# Altium schematic sheet Sheet5_Misc.SchDoc
size A4; SheetNumber: 5; SheetTotal: 5
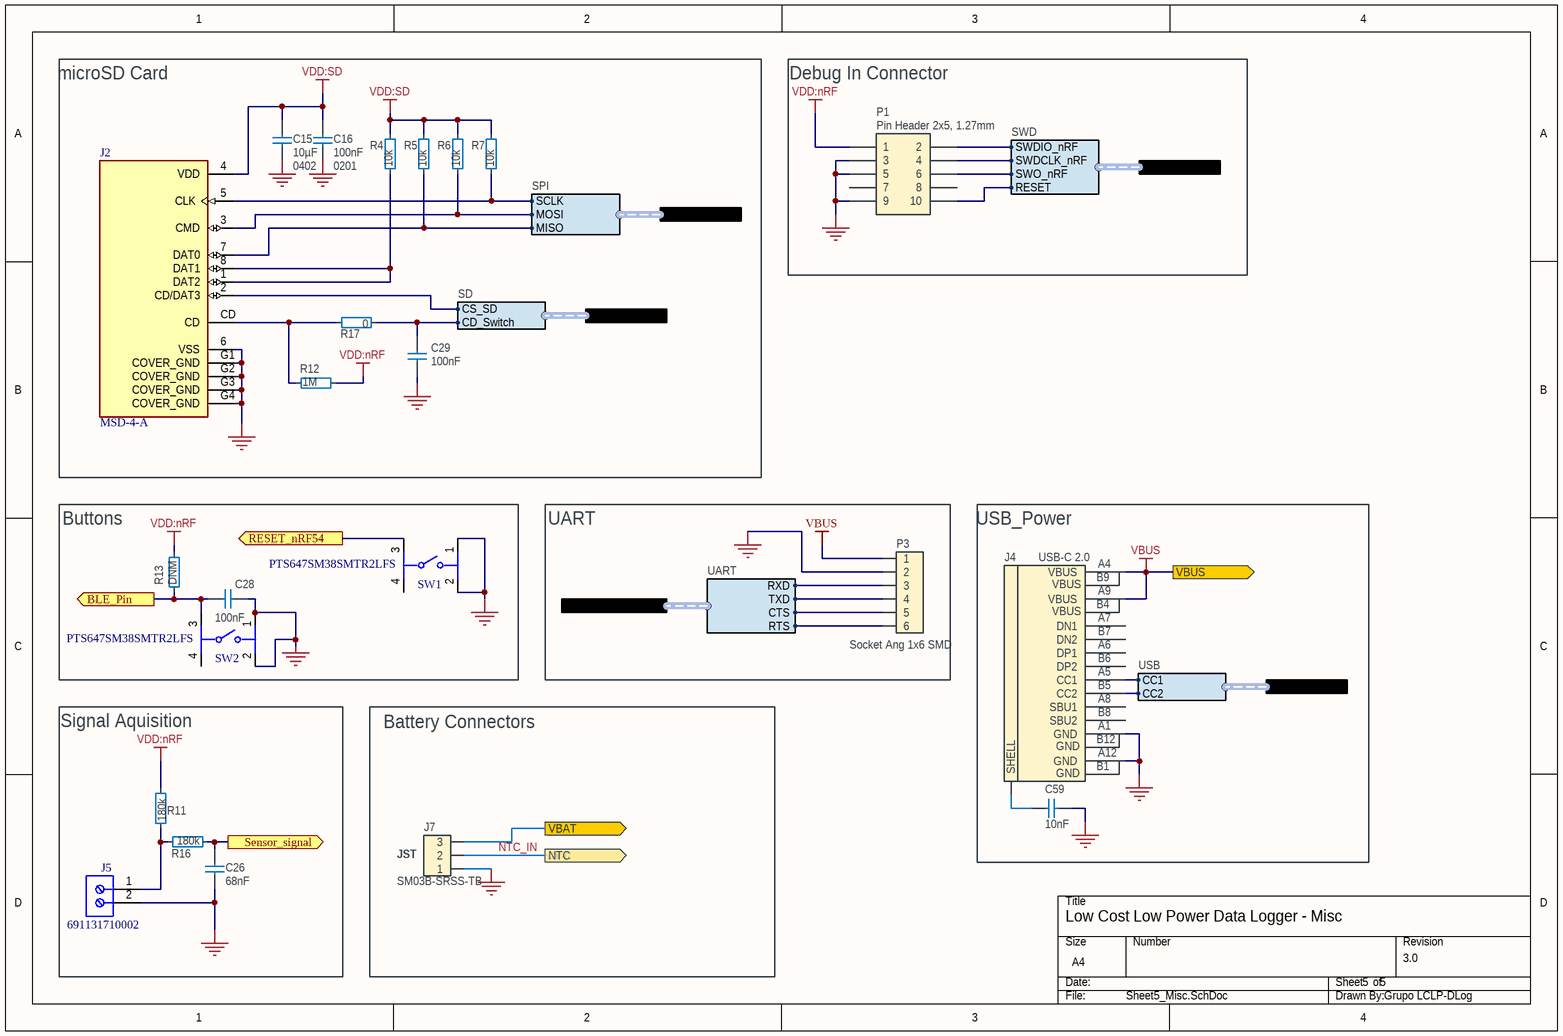
[diagram p0: Sheet5_Misc.SchDoc]

## Parts
C15  10µF  Footprint Doc: 0402  [CAPC1005X04L]
C16  100nF  Footprint Doc: 0201  [CAPC0603X03L_C]
C26  68nF  [CAPC1608X06L]
C28  100nF  [CAPC1608X06L]
C29  100nF  [CAPC1608X06L]
C59  10nF  [CAPC1608X06L]
J2  MSD-4-A  [CUI_MSD-4-A]
J4  USB-C 2.0  [SD-80259-001]
J5  691131710002  [691131710002]
J7  HDR-3, 1mm  [SM03B-SRSS-TB]  (value not drawn)
P1  Pin Header 2x5, 1.27mm  [HDR_2x5-SMD-1.27mm-K]
P3  Socket Ang 1x6 SMD  [SOCKET_1x6_SMD-ANG]
R4  10k  [RESC0603X03L_C]
R5  10k  [RESC0603X03L_C]
R6  10k  [RESC0603X03L_C]
R7  10k  [RESC0603X03L_C]
R11  180k  [RESC1005X04L]
R12  1M  [RESC1005X04L]
R13  DNM  [RESC1005X04L_NC]
R16  180k  [RESC1005X04L]
R17  0  [RESC1005X04L]
SW1  PTS647SM38SMTR2LFS  [FP-PTS647SM38SMTR2LFS-MFG]
SW2  PTS647SM38SMTR2LFS  [FP-PTS647SM38SMTR2LFS-MFG]

## Blocks framed on the sheet
microSD Card: C15 C16 C29 J2 R4-R7 R12 R17
Debug In Connector: P1
Buttons: C28 R13 SW1 SW2
UART: P3
USB_Power: C59 J4
Signal Aquisition: C26 J5 R11 R16
Battery Connectors: J7

## Ports
BLE_Pin (out, see Sheet1_Connections[4C], Sheet2_nRF54L15[4B]), NTC (out, see Sheet1_Connections[4C], Sheet3_Power_Managment[1B]), RESET_nRF54 (out, see Sheet1_Connections[4C], Sheet2_nRF54L15[4B]), SD_Pins (harness SD, see Sheet1_Connections[4B], Sheet2_nRF54L15[4A]), Sensor_signal (out, see Sheet1_Connections[4C], Sheet2_nRF54L15[4B]), SPI22 (harness SPI, see Sheet1_Connections[4B], Sheet2_nRF54L15[4A], Sheet4_Communications[2B]), SWD_Pins (harness SWD, see Sheet1_Connections[4B], Sheet2_nRF54L15[4B]), UART0_nRF54 (harness UART, see Sheet1_Connections[4B], Sheet2_nRF54L15[4B]), USB_CC (harness USB, see Sheet1_Connections[4C], Sheet3_Power_Managment[1A]), VBAT (out, see Sheet1_Connections[4C], Sheet3_Power_Managment[1B]), VBUS (out, see Sheet1_Connections[4C], Sheet3_Power_Managment[1A])

## Harnesses
SD: CS_SD, CD_Switch
UART: RXD, TXD, RTS, CTS
SPI: MISO, MOSI, SCLK
SWD: SWDIO_nRF, SWDCLK_nRF, SWO_nRF, RESET
USB: CC2, CC1

## Nets
GND: C15.1 C16.2 C26.1 C28.1 C29.1 C59.2 J2.6(VSS) J2.G1(COVER_GND) J2.G2(COVER_GND) J2.G3(COVER_GND) J2.G4(COVER_GND) J4.A1(GND) J4.A12(GND) J5.2 J7.1 P1.3 P1.5 P1.9 P3.2 SW1.1 SW1.2 SW2.1 SW2.2
VBUS: J4.A4(VBUS) J4.A9(VBUS) P3.1 ; port VBUS
VDD:nRF: P1.1 R11.2 R12.2 R13.2
VDD:SD: C15.2 C16.1 J2.4(VDD) R4.1 R5.1 R6.1 R7.1
BLE_Pin: C28.2 R13.1 SW2.3 ; port BLE_Pin
NTC_IN: J7.2 ; port NTC
RESET_nRF54: SW1.3 ; port RESET_nRF54
Sensor_signal: C26.2 R16.1 ; port Sensor_signal
VBAT: J7.3 ; port VBAT
NetC29_2: C29.2 R17.1 ; port SD_Pins.CD_Switch
NetC59_1: C59.1 J4.SHLD(SHELL)
NetJ2_1: J2.1(DAT2) J2.8(DAT1) R4.2
NetJ2_2: J2.2(CD/DAT3) ; port SD_Pins.CS_SD
NetJ2_3: J2.3(CMD) R6.2 ; port SPI22.MOSI
NetJ2_5: J2.5(CLK) R7.2 ; port SPI22.SCLK
NetJ2_7: J2.7(DAT0) R5.2 ; port SPI22.MISO
NetJ2_CD: J2.CD R12.1 R17.2
NetJ4_A5: J4.A5(CC1) ; port USB_CC.CC1
NetJ4_B5: J4.B5(CC2) ; port USB_CC.CC2
NetJ5_1: J5.1 R11.1 R16.2
NetP1_2: P1.2 ; port SWD_Pins.SWDIO_nRF
NetP1_4: P1.4 ; port SWD_Pins.SWDCLK_nRF
NetP1_6: P1.6 ; port SWD_Pins.SWO_nRF
NetP1_10: P1.10 ; port SWD_Pins.RESET
NetP3_3: P3.3 ; port UART0_nRF54.RXD
NetP3_4: P3.4 ; port UART0_nRF54.TXD
NetP3_5: P3.5 ; port UART0_nRF54.CTS
NetP3_6: P3.6 ; port UART0_nRF54.RTS

Not connected (* = marked no-connect by the designer): J4 A6(DP1) A7(DN1) A8(SBU1) B6(DP2) B7(DN2) B8(SBU2); P1 7 8; SW1 4; SW2 4

## Notes on the sheet
- (near J7) JST
- Low Cost Low Power Data Logger - Misc
- 5
- 3.0
- Grupo LCLP-DLog
- (in symbol SD-80259-1021) B9; B4; B12; B1

## Library data of the parts
C15 = C0402-10µF-6.3V-X6S: Capacitor, X6S, ±20%, 6.3V; Manufacturer: N.A.; Part number NEMS: 100200478; Component Status: Active; Pad Count: 2; Part Number: C0402-10µF-6.3V-X6S; PartId: 100200478; Component Class: Capacitors; Author: getr; Manufacturer Part Number: N.A.; ComponentLink1URL: N.A.; ComponentLink1Description: Datasheet; ComponentLink2URL: N.A.; ComponentLink2Description: Supplier link; HelpURL: N.A.; LatestRevisionDate: 2021-06-25; Published: 2021-06-25; Value: 10µF; Note: 6.3V; Supplier 1: N.A.; Supplier Part Number 1: N.A.; Supplier 2: N.A.; Supplier Part Number 2: N.A.; Artikkelnr Noca: N.A.; Part number IPS: N.A.; Part number Norautron: N.A.
C16 = C0201-100n-10V-X7R: Capacitor, X7R, ±10%; Manufacturer: N.A.; Part number NEMS: 100200469; Note: 10V; Pad Count: 2; Component Status: Active; Part Number: C0201-100n-10V-X7R; Manufacturer Part Number: N.A.; LatestRevisionDate: 2021-04-12; Published: 2021-04-12; Value: 100nF; Artikkelnr Noca: N.A.; Part number IPS: N.A.; ComponentLink1URL: N.A.; ComponentLink1Description: Datasheet; ComponentLink2URL: N.A.; ComponentLink2Description: Supplier link; HelpURL: N.A.; Supplier 1: N.A.; Supplier Part Number 1: N.A.; Supplier 2: N.A.; Supplier Part Number 2: N.A.; Component Class: Capacitors; Author: getr; Part number Norautron: N.A.; PartId: 100200469
C26 C28 C29 = C0603-10µ: Capacitor, X5R, ±20%; Manufacturer: N.A.; Part number IPS: 00000007785; Part number NEMS: 100200275; Value: 10µF; Note: 6.3V; Artikkelnr Noca: 20039234; Pad Count: 2; Component Status: Active; Part Number: C0603-10µ; Manufacturer Part Number: N.A.; ComponentLink1URL: N.A.; ComponentLink1Description: Datasheet; ComponentLink2URL: N.A.; ComponentLink2Description: Supplier link; HelpURL: N.A.; Footprint Doc: 0603; LatestRevisionDate: 2011-01-17; Published: 2011-01-17; Supplier 1: N.A.; Supplier Part Number 1: N.A.; Supplier 2: N.A.; Supplier Part Number 2: N.A.; Component Class: Capacitors; PartId: 100200275; Author: rsk; Part number Norautron: N.A.
C59 = C0603-10n-100V-X7R: Capacitor, X7R, ±10%, 100V; Manufacturer: Murata; Manufacturer Part Number: GCM188R72A103KA37D; Part number NEMS: 100200349; Component Status: Active; Pad Count: 2; Artikkelnr Noca: N.A.; Part Number: C0603-10n-100V-X7R; PartId: 100200349; Component Class: Capacitors; Author: rsk; ComponentLink1URL: N.A.; ComponentLink1Description: Datasheet; ComponentLink2URL: N.A.; ComponentLink2Description: Supplier link; HelpURL: http://psearch.en.murata.com/capacitor/product/GCM188R72A103KA37%23.pdf; LatestRevisionDate: 2017-08-22; Published: 2017-08-22; Footprint Doc: 0603; Value: 10nF; Note: 100V; Supplier 1: Digi-Key; Supplier Part Number 1: 490-4781-1-ND; Supplier 2: N.A.; Supplier Part Number 2: N.A.; Part number IPS: N.A.; Part number Norautron: N.A.
J2 = CMP-002-00071-3: Micro SD Card Connector, 9 Positions, Connector and Ejector, Push In, Auto Eject Out, Surface Mount, 1.8 mm Height Above Board, Gold Flash; MF: Same Sky; Pins: 13; Design Item ID: MSD-4-A; Case/Package: None; Source: MSD-4-A.SchLib; Component Type: Standard; Check_prices: https://www.snapeda.com/parts/MSD-4-A/Same+Sky/view-part/?ref=eda; Value: *; SnapEDA_Link: https://www.snapeda.com/parts/MSD-4-A/Same+Sky/view-part/?ref=snap; MP: MSD-4-A
J4 = SD-80259-1021: USB-C Receptacle, 16 Pin, USB 2.0; Manufacturer: Bellweather Electronic Corp.; Part number NEMS: 100500830; Component Status: Active; Pad Count: 16; Note: N.A.; System: Connector; Part Number: SD-80259-1021; PartId: 100500830; Component Class: Connectors; Author: getr; Manufacturer Part Number: SD-80259-1021; ComponentLink1URL: \\hizz\pro\app9717\Datasheet\connectors\Bellwether\SD-80259-001_C.pdf; ComponentLink1Description: Datasheet; ComponentLink2URL: N.A.; ComponentLink2Description: Supplier link; HelpURL: N.A.; LatestRevisionDate: 2023-10-30; Published: 2023-10-30; Footprint Doc: SD-80259-001; Value: USB-C 2.0; Supplier 1: Cabcon; Supplier Part Number 1: SD-80259-1021; Supplier 2: N.A.; Supplier Part Number 2: N.A.; Artikkelnr Noca: N.A.; Part number IPS: N.A.; Part number Norautron: N.A.
J5 = CMP-002-00090-1: Terminal Block, 5MM Pitch, Horizontal, Pressure Clamp, 30-12 AWG, 2 Pins, Gry; Mounting Technology: Through Hole; Min Operating Temperature: -30°C; Pins: 2; Max Operating Temperature: 120°C
J7 = SM03B-SRSS-TB: 1.0mm pitch connector side entry SMD; Manufacturer: JST Sales America Inc.; Manufacturer Part Number: SM03B-SRSS-TB(LF)(SN); Part number IPS: 00000001785; Part number Norautron: 26032360; Part number NEMS: 100500605; Note: JST, Header; Artikkelnr Noca: N.A.; Pad Count: 3; Component Status: Active; Part Number: SM03B-SRSS-TB; ComponentLink1URL: N.A.; ComponentLink1Description: Datasheet; ComponentLink2URL: N.A.; ComponentLink2Description: Supplier link; HelpURL: http://www.jst-mfg.com/product/pdf/eng/eSH.pdf; Footprint Doc: SM03B-SRSS-TB; LatestRevisionDate: 2017-10-09; Published: 2017-10-09; Value: HDR-3, 1mm; Supplier 1: Cabcon; Supplier Part Number 1: SM03B-SRSS-TB(LF)(SN); Supplier 2: Digi-Key; Supplier Part Number 2: 455-1803-1-ND; PartId: 100500605; Component Class: Connectors; Author: rsk
P1 = Pin Header 2x5 SMD, 1.27mm, KS: Pin Header 2x5, 1.27mm (50mil), SMD, Keying Shroud; Manufacturer: WCON; Manufacturer Part Number: 3132-10MS0BK00R5; Part number NEMS: 100500261; Note: (Replaced 3132-10MS0BK00R1); Artikkelnr Noca: N.A.; Pad Count: 10; Component Status: Active; System: Connector; Part Number: Pin Header 2x5 SMD, 1.27mm, KS; Footprint Doc: HDR_2x5-SMD-1.27mm; LatestRevisionDate: 2024-02-02; Published: 2016-01-22; Value: Pin Header 2x5, 1.27mm; Part number IPS: N.A.; ComponentLink1URL: N.A.; ComponentLink1Description: Datasheet; ComponentLink2URL: N.A.; ComponentLink2Description: Supplier link; HelpURL: \\hizz\pro\app9717\Datasheet\connectors\W-CON\3132-XXMXXBK00XX.pdf; Supplier 1: Cabcon; Supplier Part Number 1: 3132-10MS0BK00R5; Supplier 2: N.A.; Supplier Part Number 2: N.A.; Component Class: Connectors; PartId: 100500261; Author: rsk; Part number Norautron: N.A.
P3 = CMP-002-00096-1: Socket 1x6, 2.54mm (100mil), Right Angled, SMD; Manufacturer Part Number: 2185-106ZS0CYNRX; Part number NEMS: 100500782; Manufacturer: W-CON; Value: Socket 1x6, Angled; Artikkelnr Noca: N.A.; System: Connector; Pad Count: 6; Component Status: Active; Component Class: Connectors; Author: eisk; ComponentLink2Description: Supplier link; Note: N.A.; Design Item ID: Socket Ang 1x6 SMD; Part Number: Socket Ang 1x6 SMD; ComponentLink1Description: Datasheet; Source: pca10152.SCHLIB; PartId: 100500782; HelpURL: N.A.; ComponentLink1URL: \\hizz\pro\app9717\Datasheet\connectors\W-CON\2185-1XXZG0CYNXX.pdf; ComponentLink2URL: N.A.; Footprint Doc: SOCKET_1x6_SMD-ANG; Published: 2022-01-25; LatestRevisionDate: 2022-02-09; Part number IPS: N.A.; Part number Norautron: N.A.
R4-R7 = R0201-10k: Resistor, ±1%, 0.05W; Manufacturer: N.A.; Part number IPS: 00000001255; Part number Norautron: 26107101; Part number NEMS: 100100065; Pad Count: 2; Note: Chip Res 1%; Component Status: Active; Part Number: R0201-10k; PartId: 100100065; Component Class: Resistors; Author: rsk; Manufacturer Part Number: N.A.; ComponentLink1URL: N.A.; ComponentLink1Description: Datasheet; ComponentLink2URL: N.A.; ComponentLink2Description: Supplier link; HelpURL: N.A.; Footprint Doc: 0201; LatestRevisionDate: 2014-11-13; Published: 2014-11-13; Value: 10k; Supplier 1: N.A.; Supplier Part Number 1: N.A.; Supplier 2: N.A.; Supplier Part Number 2: N.A.; Artikkelnr Noca: N.A.
R11 = R0402-N.C.: Not mounted; Manufacturer: N.A.; Part number NEMS: 100100281; Component Status: Active; Pad Count: 2; Value: DNM; Note: Chip Res; Assembly: Not mounted; Part Number: R0402-N.C.; PartId: 100100281; Component Class: Resistors; Author: rsk; Manufacturer Part Number: N.A.; ComponentLink1URL: N.A.; ComponentLink1Description: Datasheet; ComponentLink2URL: N.A.; ComponentLink2Description: Supplier link; HelpURL: N.A.; LatestRevisionDate: 2009-05-08; Published: 2009-05-08; Footprint Doc: 0402; Supplier 1: N.A.; Supplier Part Number 1: N.A.; Supplier 2: N.A.; Supplier Part Number 2: N.A.; Artikkelnr Noca: N.A.; Part number IPS: N.A.; Part number Norautron: N.A.
R12 = R0201-10k: Resistor, ±1%, 0.05W; Manufacturer: N.A.; Part number IPS: 00000001255; Part number Norautron: 26107101; Part number NEMS: 100100065; Pad Count: 2; Value: 10k; Note: Chip Res 1%; Component Status: Active; Part Number: R0201-10k; PartId: 100100065; Component Class: Resistors; Author: rsk; Manufacturer Part Number: N.A.; ComponentLink1URL: N.A.; ComponentLink1Description: Datasheet; ComponentLink2URL: N.A.; ComponentLink2Description: Supplier link; HelpURL: N.A.; Footprint Doc: 0201; LatestRevisionDate: 2014-11-13; Published: 2014-11-13; Supplier 1: N.A.; Supplier Part Number 1: N.A.; Supplier 2: N.A.; Supplier Part Number 2: N.A.; Artikkelnr Noca: N.A.
R13 = R0402-N.C.: Not mounted; Manufacturer: N.A.; Part number NEMS: 100100281; Component Status: Active; Pad Count: 2; Note: Chip Res; Assembly: Not mounted; Part Number: R0402-N.C.; PartId: 100100281; Component Class: Resistors; Author: rsk; Manufacturer Part Number: N.A.; ComponentLink1URL: N.A.; ComponentLink1Description: Datasheet; ComponentLink2URL: N.A.; ComponentLink2Description: Supplier link; HelpURL: N.A.; LatestRevisionDate: 2009-05-08; Published: 2009-05-08; Footprint Doc: 0402; Value: DNM; Supplier 1: N.A.; Supplier Part Number 1: N.A.; Supplier 2: N.A.; Supplier Part Number 2: N.A.; Artikkelnr Noca: N.A.; Part number IPS: N.A.; Part number Norautron: N.A.
R16 R17 = R0201-1k0: Resistor, ±1%, 0.05W; Manufacturer: N.A.; Part number IPS: 00000005786; Part number NEMS: 100100043; Component Status: Active; Pad Count: 2; Value: 1k; Note: Chip Res 1%; Part Number: R0201-1k0; PartId: 100100043; Component Class: Resistors; Author: rsk; Manufacturer Part Number: N.A.; ComponentLink1URL: N.A.; ComponentLink1Description: Datasheet; ComponentLink2URL: N.A.; ComponentLink2Description: Supplier link; HelpURL: N.A.; LatestRevisionDate: 2014-11-13; Published: 2014-11-13; Supplier 1: N.A.; Supplier Part Number 1: N.A.; Supplier 2: N.A.; Supplier Part Number 2: N.A.; Artikkelnr Noca: N.A.; Part number Norautron: N.A.
SW1 SW2 = CMP-011-00014-1: Switch Tactile OFF Mom SPST Round Button Gull Wing 50mA 12VDC 100000Cycles 1.77N Surface Mount T/R; Throw Configuration: SPST; Mounting Technology: Surface Mount; Min Operating Temperature: -40°C; Max Operating Temperature: 70°C; Max Current Rating: 50mA